# Altium schematic sheet DigitalCarrierJack.SchDoc
size A4; CompanyName: Technische Hochschule Nürnberg Georg Simon Ohm; Organization: UltraZohm; Address1: Kesslerplatz 12; Address2: 90489 Nürnberg; Address3: GERMANY; DocumentNumber: 2; SheetNumber: 2; SheetTotal: 2; Website: www.ultrazohm.com
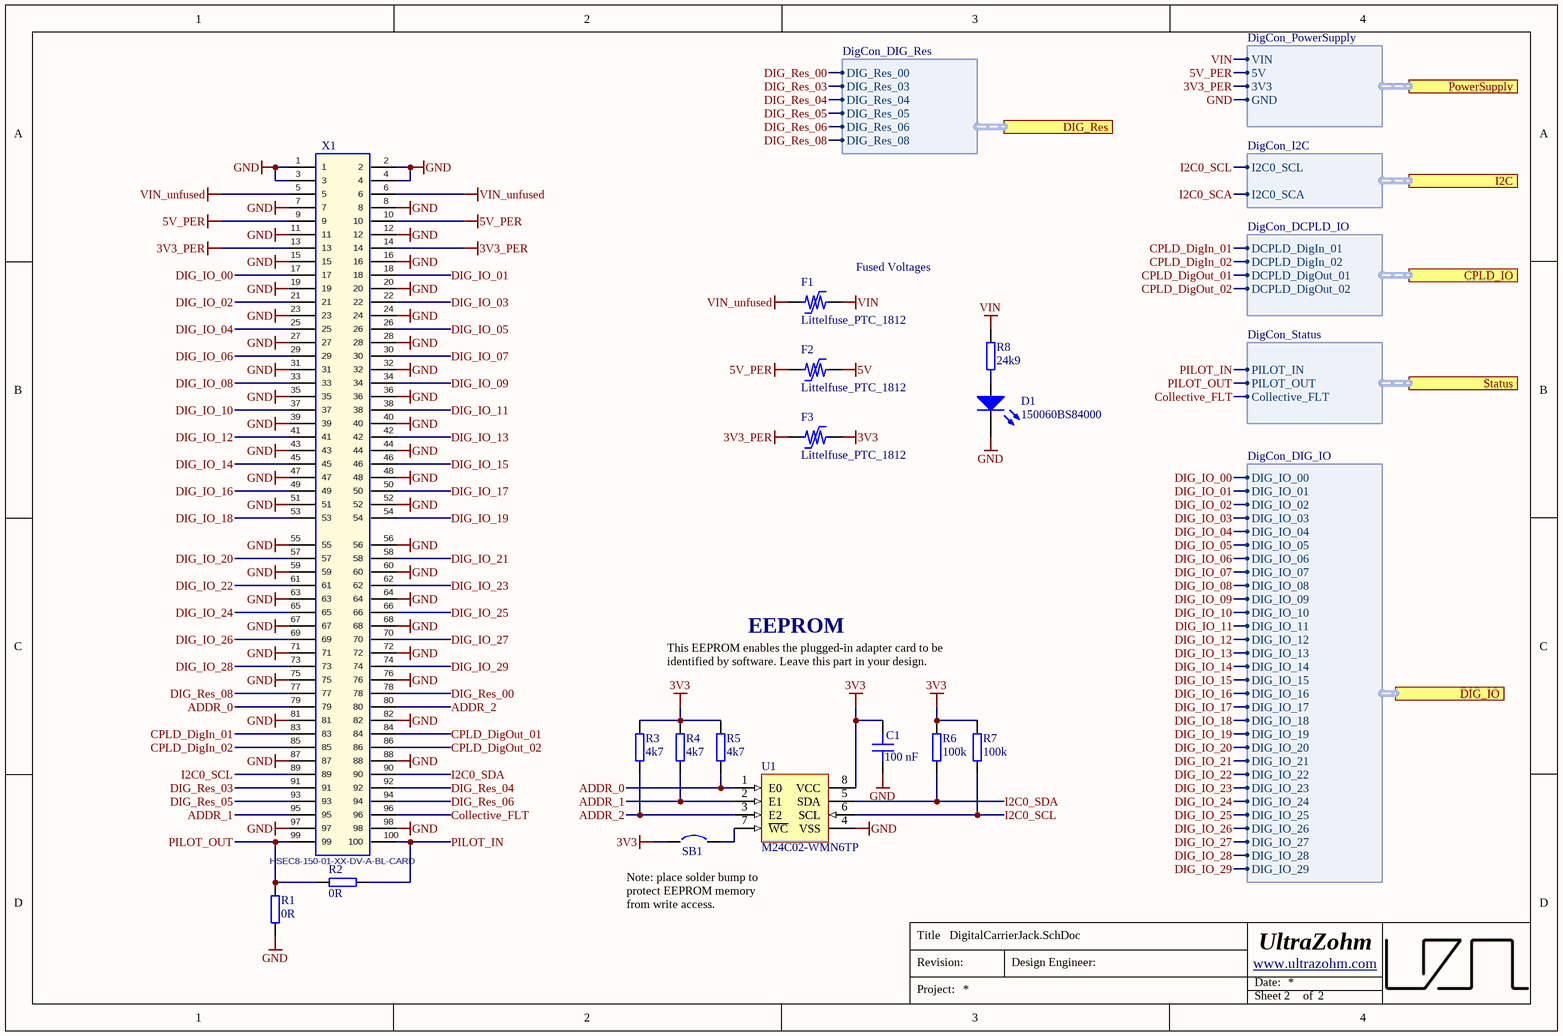
[diagram p0: DigitalCarrierJack.SchDoc]

## Parts
C1  100 nF  [C_0603]
D1  150060BS84000  [WL-SMCW_0603]
F1  Littelfuse_PTC_1812  [1812_PTC_Polyfuse_Littelfuse]
F2  Littelfuse_PTC_1812  [1812_PTC_Polyfuse_Littelfuse]
F3  Littelfuse_PTC_1812  [1812_PTC_Polyfuse_Littelfuse]
R1  0R  [RES 0603_1608]
R2  0R  [RES 0603_1608]
R3  4k7  [RES 0603_1608]
R4  4k7  [RES 0603_1608]
R5  4k7  [RES 0603_1608]
R6  100k  [RES 0603_1608]
R7  100k  [RES 0603_1608]
R8  24k9  [RES 0603_1608]
SB1  Solder Bump 0603  [SB_0603]  (value not drawn)  (no BOM)
U1  M24C02-WMN6TP  [D0008A_N]
X1  HSEC8-150-01-XX-DV-A-BL-CARD  [HSEC8-150-01-XX-DV-A-BL-CARD]  (no BOM)

## Ports
CPLD_IO (harness DigCon_DCPLD_IO), DIG_IO (harness DigCon_DIG_IO), DIG_Res (harness DigCon_DIG_Res), I2C (harness DigCon_I2C), PowerSupply (harness DigCon_PowerSupply), Status (harness DigCon_Status)

## Harnesses
DigCon_PowerSupply: GND, 3V3, 5V, VIN
DigCon_I2C: I2C0_SCA, I2C0_SCL
DigCon_Status: PILOT_IN, PILOT_OUT, Collective_FLT
DigCon_DCPLD_IO: DCPLD_DigIn_01, DCPLD_DigIn_02, DCPLD_DigOut_01, DCPLD_DigOut_02
DigCon_DIG_IO: DIG_IO_01, DIG_IO_02, DIG_IO_03, DIG_IO_04, DIG_IO_05, DIG_IO_06, DIG_IO_07, DIG_IO_08, DIG_IO_09, DIG_IO_10, DIG_IO_11, DIG_IO_12, DIG_IO_13, DIG_IO_14, DIG_IO_15, DIG_IO_16, DIG_IO_17, DIG_IO_18, DIG_IO_19, DIG_IO_20, DIG_IO_21, DIG_IO_22, DIG_IO_23, DIG_IO_24, DIG_IO_25, DIG_IO_26, DIG_IO_27, DIG_IO_28, DIG_IO_29, DIG_IO_00
DigCon_DIG_Res: DIG_Res_03, DIG_Res_04, DIG_Res_05, DIG_Res_06, DIG_Res_00, DIG_Res_08

## Nets
3V3: C1.1 F3.2 R3.2 R4.2 R5.2 R6.2 R7.2 SB1.1 U1.8(VCC)
3V3_PER: F3.1 X1.13 X1.14 ; port PowerSupply.3V3
5V: F2.2
5V_PER: F2.1 X1.9 X1.10 ; port PowerSupply.5V
GND: C1.2 D1.1(K) R1.1 U1.4(VSS) X1.1 X1.2 X1.3 X1.4 X1.7 X1.8 X1.11 X1.12 X1.15 X1.16 X1.19 X1.20 X1.23 X1.24 X1.27 X1.28 X1.31 X1.32 X1.35 X1.36 X1.39 X1.40 X1.43 X1.44 X1.47 X1.48 X1.51 X1.52 X1.55 X1.56 X1.59 X1.60 X1.63 X1.64 X1.67 X1.68 X1.71 X1.72 X1.75 X1.76 X1.81 X1.82 X1.87 X1.88 X1.97 X1.98 ; port PowerSupply.GND
VIN: F1.2 R8.2 ; port PowerSupply.VIN
VIN_unfused: F1.1 X1.5 X1.6
ADDR_0: R5.1 U1.1(E0) X1.79
ADDR_1: R4.1 U1.2(E1) X1.95
ADDR_2: R3.1 U1.3(E2) X1.80
Collective_FLT: X1.96 ; port Status.Collective_FLT
CPLD_DigIn_01: X1.83 ; port CPLD_IO.DCPLD_DigIn_01
CPLD_DigIn_02: X1.85 ; port CPLD_IO.DCPLD_DigIn_02
CPLD_DigOut_01: X1.84 ; port CPLD_IO.DCPLD_DigOut_01
CPLD_DigOut_02: X1.86 ; port CPLD_IO.DCPLD_DigOut_02
DIG_IO_00: X1.17 ; port DIG_IO.DIG_IO_00
DIG_IO_01: X1.18 ; port DIG_IO.DIG_IO_01
DIG_IO_02: X1.21 ; port DIG_IO.DIG_IO_02
DIG_IO_03: X1.22 ; port DIG_IO.DIG_IO_03
DIG_IO_04: X1.25 ; port DIG_IO.DIG_IO_04
DIG_IO_05: X1.26 ; port DIG_IO.DIG_IO_05
DIG_IO_06: X1.29 ; port DIG_IO.DIG_IO_06
DIG_IO_07: X1.30 ; port DIG_IO.DIG_IO_07
DIG_IO_08: X1.33 ; port DIG_IO.DIG_IO_08
DIG_IO_09: X1.34 ; port DIG_IO.DIG_IO_09
DIG_IO_10: X1.37 ; port DIG_IO.DIG_IO_10
DIG_IO_11: X1.38 ; port DIG_IO.DIG_IO_11
DIG_IO_12: X1.41 ; port DIG_IO.DIG_IO_12
DIG_IO_13: X1.42 ; port DIG_IO.DIG_IO_13
DIG_IO_14: X1.45 ; port DIG_IO.DIG_IO_14
DIG_IO_15: X1.46 ; port DIG_IO.DIG_IO_15
DIG_IO_16: X1.49 ; port DIG_IO.DIG_IO_16
DIG_IO_17: X1.50 ; port DIG_IO.DIG_IO_17
DIG_IO_18: X1.53 ; port DIG_IO.DIG_IO_18
DIG_IO_19: X1.54 ; port DIG_IO.DIG_IO_19
DIG_IO_20: X1.57 ; port DIG_IO.DIG_IO_20
DIG_IO_21: X1.58 ; port DIG_IO.DIG_IO_21
DIG_IO_22: X1.61 ; port DIG_IO.DIG_IO_22
DIG_IO_23: X1.62 ; port DIG_IO.DIG_IO_23
DIG_IO_24: X1.65 ; port DIG_IO.DIG_IO_24
DIG_IO_25: X1.66 ; port DIG_IO.DIG_IO_25
DIG_IO_26: X1.69 ; port DIG_IO.DIG_IO_26
DIG_IO_27: X1.70 ; port DIG_IO.DIG_IO_27
DIG_IO_28: X1.73 ; port DIG_IO.DIG_IO_28
DIG_IO_29: X1.74 ; port DIG_IO.DIG_IO_29
DIG_Res_00: X1.78 ; port DIG_Res.DIG_Res_00
DIG_Res_03: X1.91 ; port DIG_Res.DIG_Res_03
DIG_Res_04: X1.92 ; port DIG_Res.DIG_Res_04
DIG_Res_05: X1.93 ; port DIG_Res.DIG_Res_05
DIG_Res_06: X1.94 ; port DIG_Res.DIG_Res_06
DIG_Res_08: X1.77 ; port DIG_Res.DIG_Res_08
I2C0_SCA: port I2C.I2C0_SCA
I2C0_SCL: R7.1 U1.6(SCL) X1.89 ; port I2C.I2C0_SCL
I2C0_SDA: R6.1 U1.5(SDA) X1.90
PILOT_IN: R2.1 X1.100 ; port Status.PILOT_IN
PILOT_OUT: R1.2 R2.2 X1.99 ; port Status.PILOT_OUT
NetD1_2: D1.2(A) R8.1
NetSB1_2: SB1.2 U1.7(~{WC})

## Notes on the sheet
- (near F1) Fused Voltages
- EEPROM
- This EEPROM enables the plugged-in adapter card to be identified by software. Leave this part in your design.
- Note: place solder bump to protect EEPROM memory from write access.
- Title
- Revision:
- Design Engineer:
- Date:
- Project:
- Sheet
- of

## Library data of the parts
C1 = C0603C104K9PACTU: Capacitor 0603, 6.3 VDC, 100 nF, X5R; Manufacturer: KEMET; Tolerance: 10 %; Voltage Rating: 6.3 VDC; Created from: MGremer; Manufacturer Part Number: C0603C104K9PACTU; PartID: 70; Created On: 20.12.2020 13:54:13; ComponentLink1Description: Datasheet; ComponentLink1URL: https://www.mouser.de/datasheet/2/212/KEM_C1006_X5R_SMD-1103249.pdf; Component Type: Capacitor 0603; Device Package: 0603; Last Updated: 20.01.2021 13:57:36; Mounting Type: SMD; Operating Temperature: -55 - 85°C; Series: SMD Comm X5R; Supplier 1: Mouser; Supplier Part Number 1: 80-C0603C104K9P; Type: Capacitor; Value: 100 nF; Live Cycle Status: 1; Stock number: not stored
D1 = 150060BS84000: WL-SMCW SMD Mono-color Chip LED Waterclear Blue; Manufacturer: Wuerth Elektronik; Type: Standard; Created from: MGremer; Forward Current I_f: 20 mA; Forward Voltage U_f: 3.2 V; Wavelength: 470 nm; Light Intensity: 560 mcd; Nominal Power: 78 mW; Manufacturer Part Number: 150060BS84000; PartID: 1; Created On: 08.12.2020 10:19:38; ComponentLink1Description: Datasheet; ComponentLink1URL: https://www.mouser.de/datasheet/2/445/150060BS84000-1838909.pdf; Component Type: LED Diode; Device Package: 0603; Last Updated: 03.03.2021 09:59:51; Mounting Type: SMD; Operating Temperature: -40 - 85 °C; Supplier 1: Mouser; Supplier Part Number 1: 710-150060BS84000; Supplier 2: Farnell; Supplier Part Number 2: 3408611; Supplier 3: Digi-Key; Supplier Part Number 3: 732-150060BS84000CT-ND; Live Cycle Status: 1; Stock number: not stored; Color: blue
F1-F3 = Littelfuse_PTC_1812: POLYSWITCH RESETTABLE DEVICES; MPN: miniASMDC110F/24; Value: PTC, 1.1 A, 24V; Voltage: 24V; Trip Current: 2.2A; Hold Current: 1.1A; Resistance: 0.18 Ohm; Type: Fuse; Nominal current: 1 A; Created from: MHlatky; MF: Littelfuse; Created: 2019_02_10_AGeiger; Package: 1812; ComponentLink1URL: https://www.littelfuse.com/~/media/electronics/datasheets/resettable_ptcs/littelfuse_ptc_surface_mount_catalog_datasheet.pdf.pdf; ComponentLink1Description: Datasheet; Manufacturer Part Number: Littelfuse_PTC_1812; PartID: 5; Created On: 07.05.2021 06:50:33; Component Type: Littelfuse_PTC_1812; Last Updated: 27.05.2022 15:06:17; Manufacturer: Littelfuse; Mounting Type: SMD; Operating Temperature: -40 - 85 °C; Supplier 1: Mouser; Supplier Part Number 1: 530-0ZCG0150BF2C; Live Cycle Status: 1; LCSC Part Number: C70119
R1 R2 = RC0603JR-070RL: SMD resistor E24 series; Manufacturer: YAGEO; Tolerance: 5%; Created from: MGremer; Manufacturer Part Number: RC0603JR-070RL; PartID: 1; Created On: 14.12.2020 16:17:14; ComponentLink1Description: Datasheet; ComponentLink1URL: https://www.mouser.de/datasheet/2/447/PYu-RC_Group_51_RoHS_L_10-1664068.pdf; Component Type: SMD resistor; Device Package: 0603; Last Updated: 04.03.2021 09:09:42; Mounting Type: SMD; Supplier 1: Mouser; Supplier Part Number 1: 603-RC0603JR-070RL; Supplier 2: LCSC; Supplier Part Number 2: C21189; Type: Resistor; Value: 0R; Live Cycle Status: 1; Stock number: Labor SMD Container; LCSC Part Number: C21189
R3-R5 = 0603WAF4701T5E: SMD resistor E24 series; Manufacturer: UNI-ROYAL; Tolerance: 1%; Created from: AGeiger; Manufacturer Part Number: 0603WAF4701T5E; PartID: 90; Created On: 14.12.2020 16:17:14; ComponentLink1Description: Datasheet; ComponentLink1URL: https://datasheet.lcsc.com/lcsc/2206010116_UNI-ROYAL-Uniroyal-Elec-0603WAF4701T5E_C23162.pdf; Component Type: SMD resistor; Device Package: 0603; Last Updated: 25.08.2022 20:03:04; Mounting Type: SMD; Supplier 1: LCSC; Supplier Part Number 1: C23162; Type: Resistor; Value: 4k7; Live Cycle Status: 1; Stock number: Labor SMD Container; LCSC Part Number: C23162
R6 R7 = RK73B1JTTD104J: SMD resistor E24 series; Manufacturer: KOA Speer; Tolerance: 5%; Created from: MGremer; Manufacturer Part Number: RK73B1JTTD104J; PartID: 122; Created On: 14.12.2020 16:17:14; ComponentLink1Description: Datasheet; ComponentLink1URL: https://www.mouser.de/datasheet/2/219/RK73B-1825463.pdf; Component Type: SMD resistor; Device Package: 0603; Last Updated: 27.05.2022 14:04:10; Mounting Type: SMD; Supplier 1: Mouser; Supplier Part Number 1: 660-RK73B1JTTD104J; Type: Resistor; Value: 100k; Live Cycle Status: 1; Stock number: Labor SMD Container; LCSC Part Number: C25803
R8 = CRCW060324K9FKEA: SMD resistor 1%; Manufacturer: Vishay; Created from: MGremer; Manufacturer Part Number: CRCW060324K9FKEA; PartID: 157; Created On: 14.12.2020 16:17:14; ComponentLink1Description: Datasheet; ComponentLink1URL: https://www.mouser.de/datasheet/2/427/dcrcwe3-1762152.pdf; Component Type: SMD resistor; Device Package: 0603; Last Updated: 02.03.2021 14:07:32; Mounting Type: SMD; Supplier 1: Mouser; Supplier Part Number 1: 71-CRCW0603-24.9K-E3; Type: Resistor; Tolerance: 1%; Value: 24k9; Live Cycle Status: 1; Stock number: not stored
SB1 = =Value: Created from: AGeiger; Revision: July-2002: Re-released for DXP Platform.; PartID: 1; Created On: 09.01.2024 17:13:56; Component Type: Solder Bump; Device Package: 0603; Last Updated: 09.01.2024 17:13:56; Manufacturer Part Number: Solder Bump 0603; Mounting Type: SMD; Value: Solder Bump 0603
U1 = M24C02-WMN6TP: 2Kbit I2C SOP-8 EEPROM ROHS; Manufacturer: STMicroelectronics; Created from: AGeiger; Manufacturer Part Number: M24C02-WMN6TP; PartID: 1; Created On: 19.11.2023 14:54:27; ComponentLink1Description: Datasheet; ComponentLink1URL: https://www.st.com/resource/en/datasheet/m24c01-w.pdf; Component Type: EEPROM; Device Package: SOIC-8; Last Updated: 19.11.2023 21:39:04; Mounting Type: SMD; Operating Temperature: -40 to +85 °C; Series: M24xxx; Supplier 1: Mouser; Supplier Part Number 1: 511-M24C02-WMN6TP; Supplier 2: LCSC; Supplier Part Number 2: C7562; Type: Memory; Value: M24C02-WMN6TP; LCSC Part Number: C7562
X1 = HSEC8-150-01-XX-DV-A-BL-CARD: Mating Card Layout for HSEC8-150-01-XX-DV-A-BL; Manufacturer: SAMTEC; Created: 2018_04_23_AGeiger; Value: HSEC8-150-01-XX-DV-A-BL-CARD